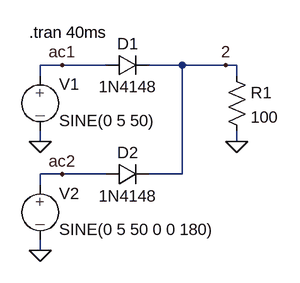
[diagram p0: schematic gleichrichter_zweiweg.asc]
gleichrichter_zweiweg.asc, the LTspice schematic file:
Version 4
SHEET 1 880 680
WIRE 96 112 64 112
WIRE 160 112 96 112
WIRE 272 112 224 112
WIRE 336 112 272 112
WIRE 352 112 336 112
WIRE 64 128 64 112
WIRE 352 128 352 112
WIRE 64 224 64 208
WIRE 352 224 352 208
WIRE 96 272 64 272
WIRE 160 272 96 272
WIRE 272 272 272 112
WIRE 272 272 224 272
WIRE 64 288 64 272
WIRE 64 384 64 368
FLAG 352 224 0
FLAG 64 224 0
FLAG 336 112 2
FLAG 96 112 ac1
FLAG 64 384 0
FLAG 96 272 ac2
SYMBOL diode 160 128 R270
WINDOW 0 32 32 VTop 2
WINDOW 3 0 32 VBottom 2
SYMATTR InstName D1
SYMATTR Value 1N4148
SYMBOL res 336 112 R0
SYMATTR InstName R1
SYMATTR Value 100
SYMBOL source-V 64 112 R0
WINDOW 123 0 0 Left 2
WINDOW 39 0 0 Left 2
SYMATTR InstName V1
SYMATTR Value SINE(0 5 50)
SYMBOL diode 160 288 R270
WINDOW 0 32 32 VTop 2
WINDOW 3 0 32 VBottom 2
SYMATTR InstName D2
SYMATTR Value 1N4148
SYMBOL source-V 64 272 R0
WINDOW 123 0 0 Left 2
WINDOW 39 0 0 Left 2
SYMATTR InstName V2
SYMATTR Value SINE(0 5 50 0 0 180)
TEXT 48 64 Left 2 !.tran 40ms

The netlist it stands for:
* gleichrichter_zweiweg.asc
D1 ac1 2 1N4148
R1 2 0 100
V1 ac1 0 SINE(0 5 50)
D2 ac2 2 1N4148
V2 ac2 0 SINE(0 5 50 0 0 180)
.model D D
.lib standard.dio
.tran 40ms
.backanno
.end